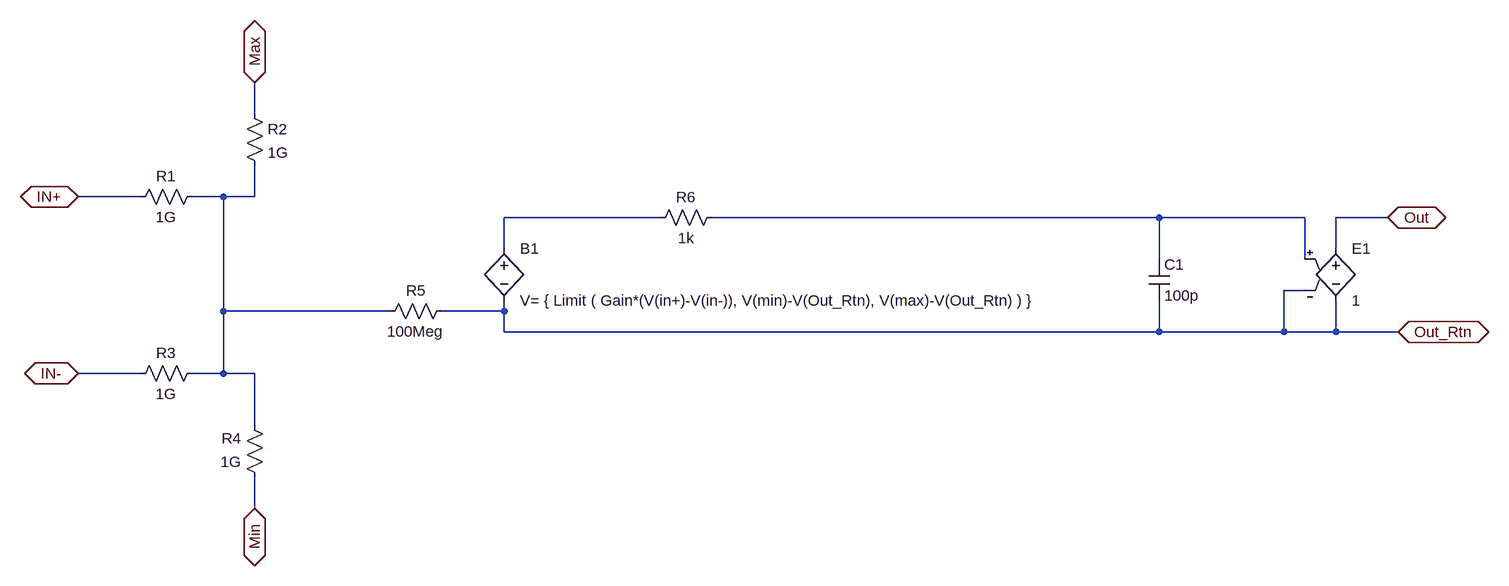
[diagram p0: schematic Voltage_Amp.asc]
Voltage_Amp.asc, the LTspice schematic file:
Version 4.1
SHEET 1 2092 680
WIRE 176 -80 176 -128
WIRE 0 48 -96 48
WIRE 128 48 80 48
WIRE 176 48 176 0
WIRE 176 48 128 48
WIRE 800 80 560 80
WIRE 1568 80 880 80
WIRE 1792 80 1568 80
WIRE 1920 80 1840 80
WIRE 560 128 560 80
WIRE 1840 128 1840 80
WIRE 1568 144 1568 80
WIRE 1792 144 1792 80
WIRE 1792 192 1760 192
WIRE 128 224 128 48
WIRE 384 224 128 224
WIRE 560 224 560 208
WIRE 560 224 464 224
WIRE 560 256 560 224
WIRE 1568 256 1568 208
WIRE 1568 256 560 256
WIRE 1760 256 1760 192
WIRE 1760 256 1568 256
WIRE 1840 256 1840 208
WIRE 1840 256 1760 256
WIRE 1936 256 1840 256
WIRE 0 320 -96 320
WIRE 128 320 128 224
WIRE 128 320 80 320
WIRE 176 320 128 320
WIRE 176 400 176 320
WIRE 176 528 176 480
FLAG 176 -128 Max
IOPIN 176 -128 BiDir
FLAG -96 320 IN-
IOPIN -96 320 BiDir
FLAG 176 528 Min
IOPIN 176 528 BiDir
FLAG -96 48 IN+
IOPIN -96 48 BiDir
FLAG 1920 80 Out
IOPIN 1920 80 BiDir
FLAG 1936 256 Out_Rtn
IOPIN 1936 256 BiDir
SYMBOL res 96 32 R90
WINDOW 0 0 56 VBottom 2
WINDOW 3 32 56 VTop 2
SYMATTR InstName R1
SYMATTR Value 1G
SYMBOL res 160 -96 R0
SYMATTR InstName R2
SYMATTR Value 1G
SYMBOL res 96 304 R90
WINDOW 0 0 56 VBottom 2
WINDOW 3 32 56 VTop 2
SYMATTR InstName R3
SYMATTR Value 1G
SYMBOL res 192 496 R180
WINDOW 0 36 76 Left 2
WINDOW 3 36 40 Left 2
SYMATTR InstName R4
SYMATTR Value 1G
SYMBOL res 480 208 R90
WINDOW 0 0 56 VBottom 2
WINDOW 3 32 56 VTop 2
SYMATTR InstName R5
SYMATTR Value 100Meg
SYMBOL bv 560 112 R0
SYMATTR InstName B1
SYMATTR Value V= { Limit ( Gain*(V(in+)-V(in-)), V(min)-V(Out_Rtn), V(max)-V(Out_Rtn) ) }
SYMBOL res 896 64 R90
WINDOW 0 0 56 VBottom 2
WINDOW 3 32 56 VTop 2
SYMATTR InstName R6
SYMATTR Value 1k
SYMBOL cap 1552 144 R0
SYMATTR InstName C1
SYMATTR Value 100p
SYMBOL e 1840 112 R0
SYMATTR InstName E1
SYMATTR Value 1

The netlist it stands for:
* Voltage_Amp.asc
R1 N001 IN+ 1G
R2 Max N001 1G
R3 N001 IN- 1G
R4 Min N001 1G
R5 Out_Rtn N001 100Meg
B1 N002 Out_Rtn V= { Limit ( Gain*(V(in+)-V(in-)), V(min)-V(Out_Rtn), V(max)-V(Out_Rtn) ) }
R6 N003 N002 1k
C1 N003 Out_Rtn 100p
E1 Out Out_Rtn N003 Out_Rtn 1
.backanno
.end